# Altium schematic sheet Inrus.SchDoc
size 420 x 297 mm; SheetNumber: 1; SheetTotal: 3
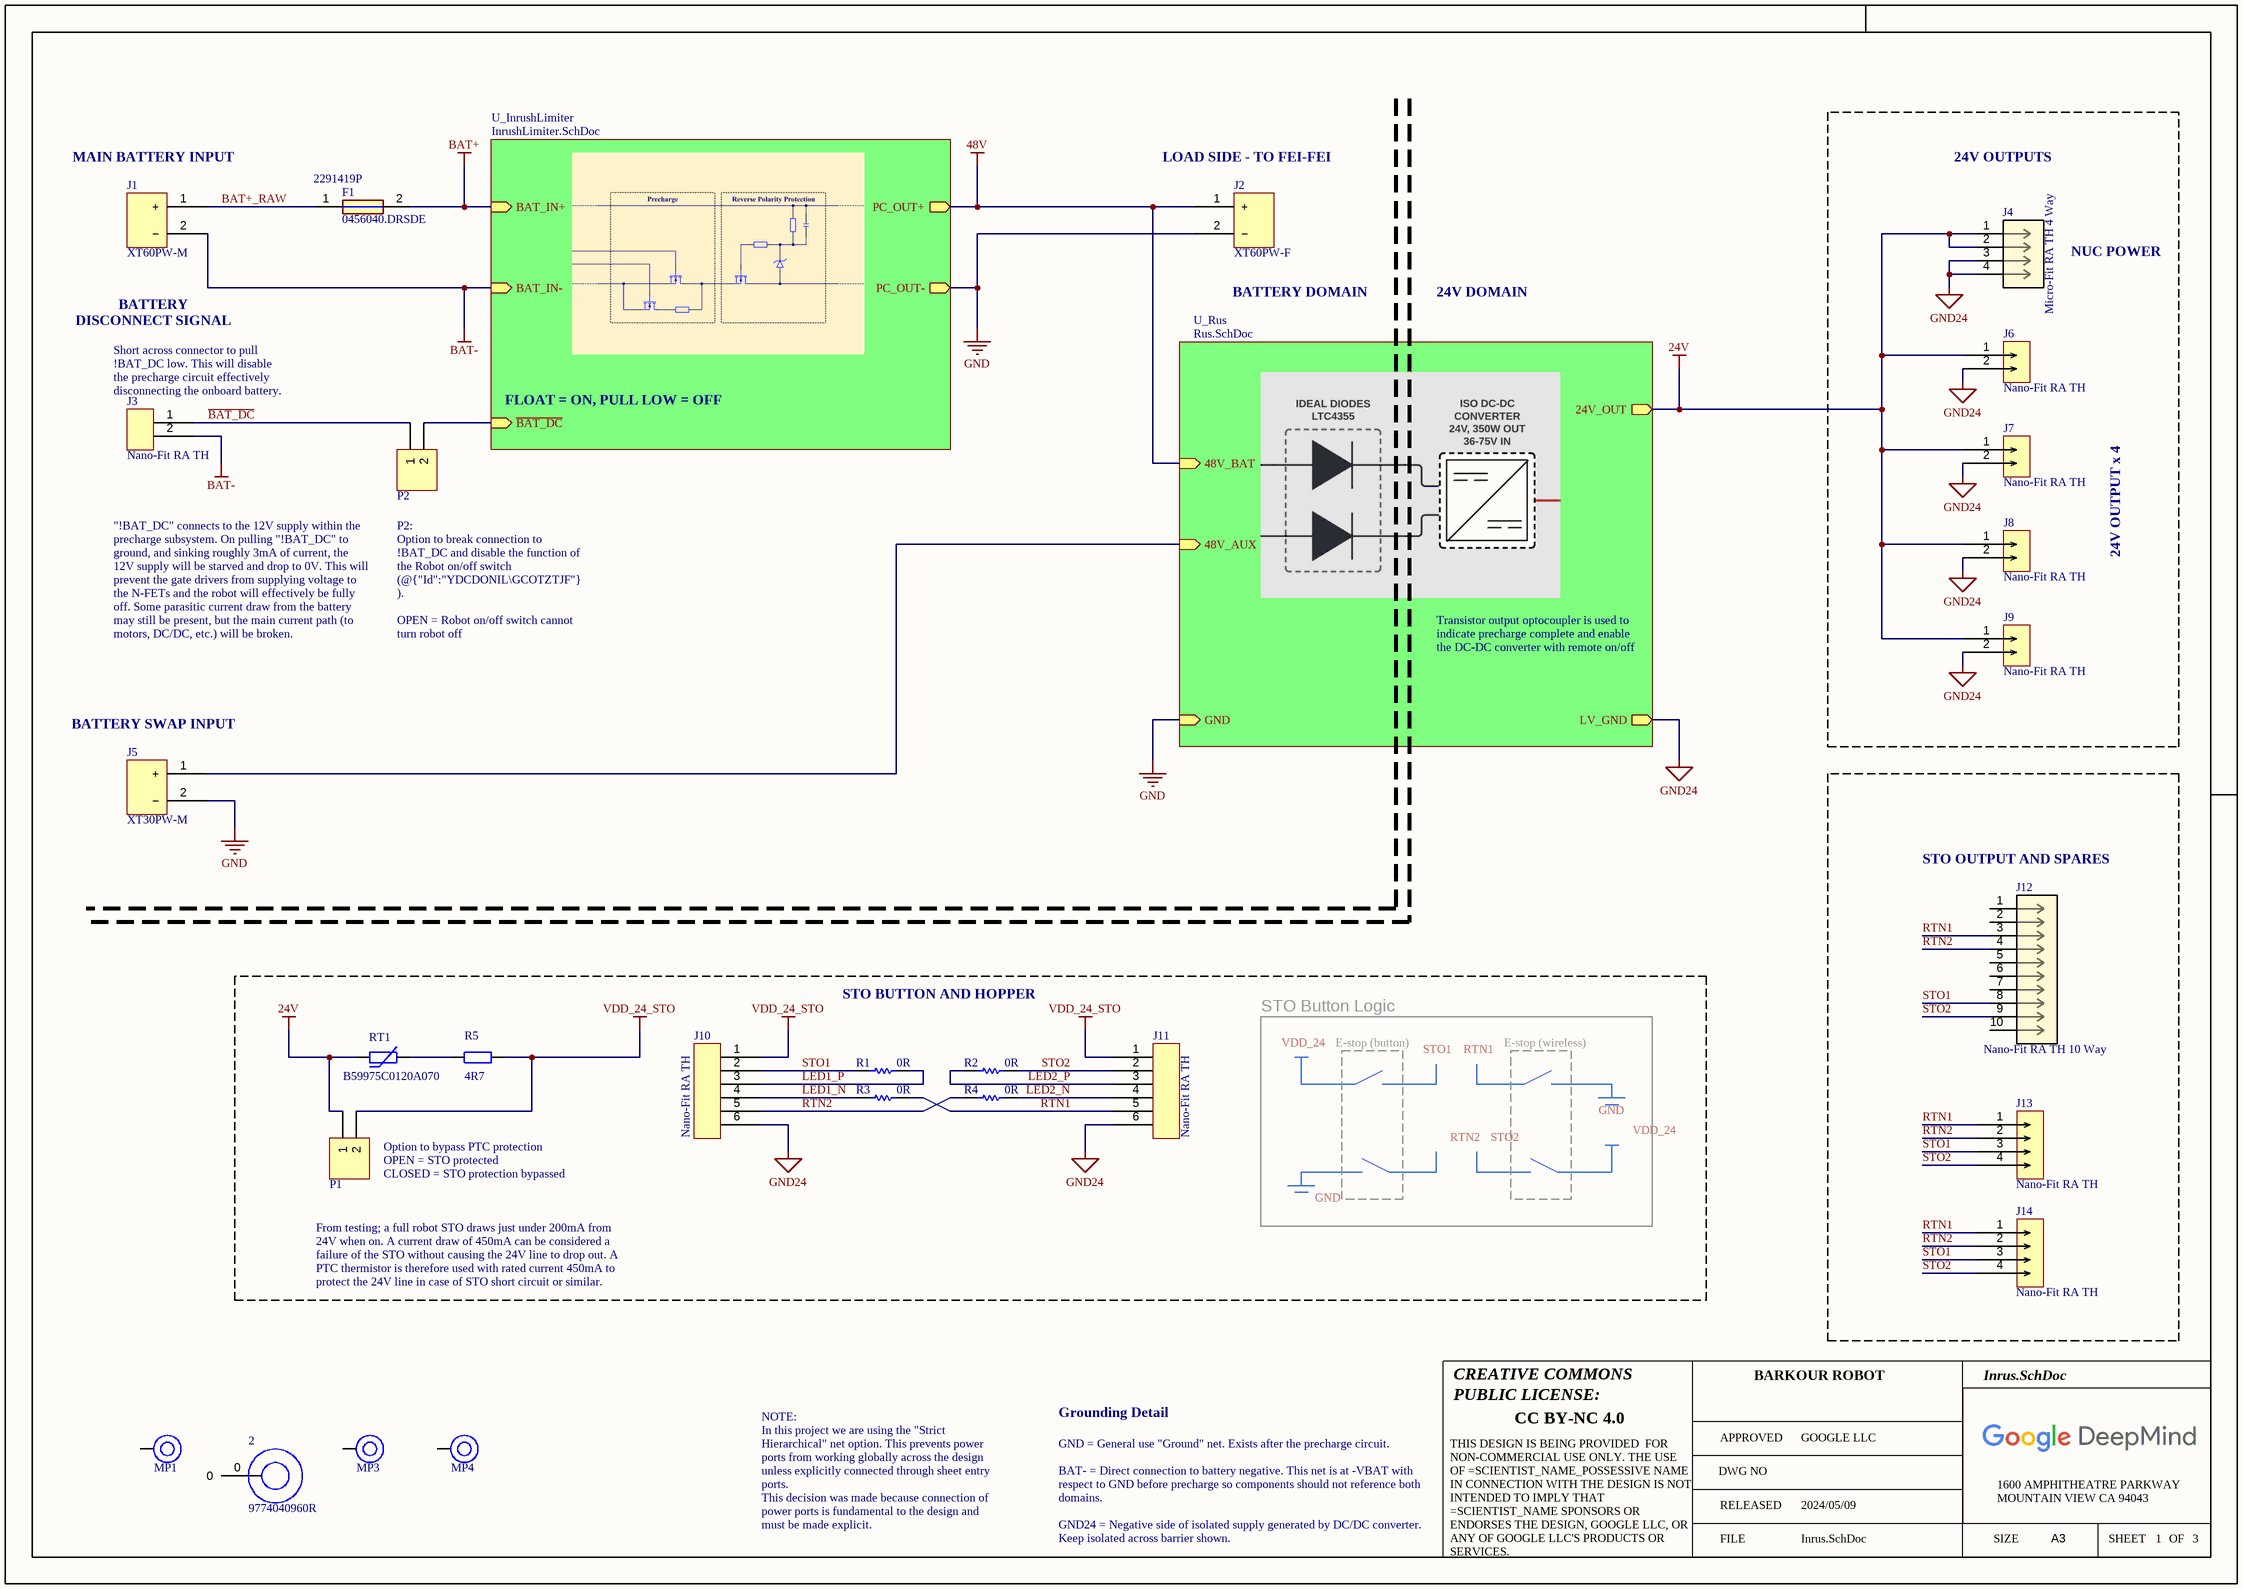
[diagram p0: Inrus.SchDoc]

## Parts
2  9774040960R  [9774040960R]
F1  0456040.DRSDE  Supplier Part Number 1: 2291419P  [FUSC12245X450N]
J1  XT60PW-M  [XT60PW_M]
J2  XT60PW-F  [XT60PW_F]
J3  Colloquial: Nano-Fit RA TH  [MOLEX 1053131102]  (hidden comment: 105313-1202)
J4  Colloquial: Micro-Fit RA TH 4 Way  [MOLEX 430450401]  (hidden comment: 430450401)
J5  XT30PW-M  [XT30PW_M]
J6  Colloquial: Nano-Fit RA TH  [MOLEX 1053131102]  (hidden comment: 105313-1202)
J7  Colloquial: Nano-Fit RA TH  [MOLEX 1053131102]  (hidden comment: 105313-1202)
J8  Colloquial: Nano-Fit RA TH  [MOLEX 1053131102]  (hidden comment: 105313-1202)
J9  Colloquial: Nano-Fit RA TH  [MOLEX 1053131102]  (hidden comment: 105313-1202)
J10  Colloquial: Nano-Fit RA TH  [MOLEX 1053141206]  (hidden comment: 105314-1206)
J11  Colloquial: Nano-Fit RA TH  [MOLEX 1053141206]  (hidden comment: 105314-1206)
J12  Colloquial: Nano-Fit RA TH 10 Way  [MOLEX 1053141110]  (hidden comment: 1053141310)
J13  Colloquial: Nano-Fit RA TH  [MOLEX 1053141204]  (hidden comment: 105314-1204)
J14  Colloquial: Nano-Fit RA TH  [MOLEX 1053141204]  (hidden comment: 105314-1204)
MP1  M3 x 4mm  [9774040360]  (value not drawn)
MP3  M3 x 4mm  [9774040360]  (value not drawn)
MP4  M3 x 4mm  [9774040360]  (value not drawn)
P1  Header 2  [HDR1X2]  (value not drawn)
P2  Header 2  [HDR1X2]  (value not drawn)
R1  Resistance: 0R  [RESC1608X55X25ML10T15]  (hidden comment: RC0603JR-070RL)
R2  Resistance: 0R  [RESC1608X55X25ML10T15]  (hidden comment: RC0603JR-070RL)
R3  Resistance: 0R  [RESC1608X55X25ML10T15]  (hidden comment: RC0603JR-070RL)
R4  Resistance: 0R  [RESC1608X55X25ML10T15]  (hidden comment: RC0603JR-070RL)
R5  4R7  [RES 2512_6432]
RT1  B59975C0120A070  [RES THERM TH 9.0x12.5 DISC LEADED]

## Blocks framed on the sheet
STO OUTPUT AND SPARES: J12-J14
STO Button Logic: J10 J11 P1 R1-R5 RT1

## Sub-sheets
U_InrushLimiter = InrushLimiter.SchDoc: BAT_IN+ (in), BAT_IN- (in), PC_OUT+ (out), PC_OUT- (out), ~{BAT_DC} (in)
U_Rus = Rus.SchDoc: 48V_BAT (in), 48V_AUX (in), 24V_OUT (out), LV_GND (out), GND (in)

## Nets
24V: J4.1 J4.2 J6.1 J7.1 J8.1 J9.1 P1.1 RT1.1 ; sheet U_Rus/24V_OUT
48V: J2.1(+) ; sheet U_InrushLimiter/PC_OUT+, sheet U_Rus/48V_BAT
BAT+: F1.2 ; sheet U_InrushLimiter/BAT_IN+
BAT-: J1.2(−) J3.2 ; sheet U_InrushLimiter/BAT_IN-
GND: J2.2(−) J5.2(−) ; sheet U_InrushLimiter/PC_OUT-, sheet U_Rus/GND
GND24: J4.3 J4.4 J6.2 J7.2 J8.2 J9.2 J10.6 J11.6 ; sheet U_Rus/LV_GND
VDD_24_STO: J10.1 J11.1 P1.2 R5.2
~{BAT_DC}: J3.1 P2.1
BAT+_RAW: F1.1 J1.1(+)
LED1_N: J10.4 R3.2
LED1_P: J10.3 R1.1
LED2_N: J11.4 R4.2
LED2_P: J11.3 R2.1
RTN1: J11.5 J12.3 J13.1 J14.1 R3.1
RTN2: J10.5 J12.4 J13.2 J14.2 R4.1
STO1: J10.2 J12.8 J13.3 J14.3 R1.2
STO2: J11.2 J12.9 J13.4 J14.4 R2.2
NetJ5_1: J5.1(+) ; sheet U_Rus/48V_AUX
NetP2_2: P2.2 ; sheet U_InrushLimiter/~{BAT_DC}
NetR5_1: R5.1 RT1.2

Not connected (* = marked no-connect by the designer): 2 0; J12 1 2 5 6 7 10; MP1 1; MP3 1; MP4 1

## Notes on the sheet
- (near J1) MAIN BATTERY INPUT
- (near J2) LOAD SIDE - TO FEI-FEI
- 24V OUTPUTS
- NUC POWER
- BATTERY DOMAIN
- 24V DOMAIN
- BATTERY DISCONNECT SIGNAL
- (near J3) Short across connector to pull !BAT_DC low. This will disable the precharge circuit effectively disconnecting the onboard battery.
- FLOAT = ON, PULL LOW = OFF
- 24V OUTPUT x 4
- "!BAT_DC" connects to the 12V supply within the precharge subsystem. On pulling "!BAT_DC" to ground, and sinking roughly 3mA of current, the 12V supply will be starved and drop to 0V. This will prevent the gate drivers from supplying voltage to the N-FETs and the robot will effectively be fully off. Some parasitic current draw from the battery may still be present, but the main current path (to motors, DC/DC, etc.) will be broken.
- P2:
  Option to break connection to !BAT_DC and disable the function of the Robot on/off switch (@{"Id":"YDCDONIL\GCOTZTJF"} ).
  OPEN = Robot on/off switch cannot turn robot off
  CLOSED (default) = Robot on/off switch functional
- (near J5) BATTERY SWAP INPUT
- Transistor output optocoupler is used to indicate precharge complete and enable the DC-DC converter with remote on/off
- STO BUTTON AND HOPPER
- VDD_24
- E-stop (button)
- STO1
- RTN1
- E-stop (wireless)
- GND
- (near P1) Option to bypass PTC protection
  OPEN = STO protected
  CLOSED = STO protection bypassed
- RTN2
- STO2
- From testing; a full robot STO draws just under 200mA from 24V when on. A current draw of 450mA can be considered a failure of the STO without causing the 24V line to drop out. A PTC thermistor is therefore used with rated current 450mA to protect the 24V line in case of STO short circuit or similar.
- Grounding Detail
- NOTE:
  In this project we are using the "Strict Hierarchical" net option. This prevents power ports from working globally across the design unless explicitly connected through sheet entry ports.
  This decision was made because connection of power ports is fundamental to the design and must be made explicit.
- GND = General use "Ground" net. Exists after the precharge circuit.
  BAT- = Direct connection to battery negative. This net is at -VBAT with respect to GND before precharge so components should not reference both domains.
  GND24 = Negative side of isolated supply generated by DC/DC converter. Keep isolated across barrier shown.
- CREATIVE COMMONS
- PUBLIC LICENSE:
- BARKOUR ROBOT
- CC BY-NC 4.0
- APPROVED
- DWG NO
- GOOGLE LLC
- FILE
- RELEASED
- 2024/05/09
- SIZE
- 1600 AMPHITHEATRE PARKWAY
- MOUNTAIN VIEW CA 94043
- A3
- SHEET
- OF
- THIS DESIGN IS BEING PROVIDED  FOR NON-COMMERCIAL USE ONLY. THE USE OF =SCIENTIST_NAME_POSSESSIVE NAME IN CONNECTION WITH THE DESIGN IS NOT INTENDED TO IMPLY THAT =SCIENTIST_NAME SPONSORS OR ENDORSES THE DESIGN, GOOGLE LLC, OR ANY OF GOOGLE LLC'S PRODUCTS OR SERVICES.

## Library data of the parts
2 = 9774040960R: Spacer Material: Steel Mounting: SMT Series: WA-SMST For ø: 3.3 mm; Manufacturer: Wurth Electronics; Plating: Tin; Threaded/Unthreaded: Unthreaded; Inside Diameter: 0.13inch; Outside Diameter: 0.236inch; Supplier 1: Digi-Key; Manufacturer Part Number: 9774040960R; RoHS: Yes; Category: Spacers, Standoffs; Stock 1: 190; Pricing 1: 1=1.79000, 10=1.71600, 50=1.50700, 100=1.40200 (USD); Material: Steel; Length: 0.213inch; REACH SVHC: Unknown; ComponentLink1URL: http://www.farnell.com/datasheets/1960394.pdf?src-supplier=Farnell; ComponentLink1Description: http://www.farnell.com/datasheets/1960394.pdf?src-supplier=Farnell; ComponentLink2URL: http://www.mouser.com/ds/2/445/9774040960R-611108.pdf?src-supplier=Mouser; ComponentLink2Description: http://www.mouser.com/ds/2/445/9774040960R-611108.pdf?src-supplier=Mouser; ComponentLink3URL: https://media.digikey.com/pdf/Data%20Sheets/Wurth%20Electronics%20PDFs/WA-SMSx_Performance_Flyer.pdf?src-supplier=Digi-Key; ComponentLink3Description: https://media.digikey.com/pdf/Data%20Sheets/Wurth%20Electronics%20PDFs/WA-SMSx_Performance_Flyer.pdf?src-supplier=Digi-Key; ComponentLink4URL: http://www.farnell.com/datasheets/1960394.pdf?src-supplier=Element14; ComponentLink4Description: http://www.farnell.com/datasheets/1960394.pdf?src-supplier=Element14; ComponentLink5URL: http://www.farnell.com/datasheets/1960394.pdf?src-supplier=Newark; ComponentLink5Description: http://www.farnell.com/datasheets/1960394.pdf?src-supplier=Newark; Supplier Part Number 1: 732-7092-1-ND
F1 = 0456040.DRSDE: Electric Fuse, Fast Blow, 40A, 250VAC, 80VDC, 150A (IR), Surface Mount, NANO; Manufacturer_Name: LITTELFUSE; Datasheet Link: https://www.littelfuse.com/~/media/electronics/datasheets/fuses/littelfuse_fuse_456sde_datasheet.pdf.pdf; Height: 4.5mm; Manufacturer_Part_Number: 0456040.DRSDE; Mouser Part Number: 576-0456040.DRSDE; Mouser Price/Stock: https://www.mouser.co.uk/ProductDetail/Littelfuse/0456040.DRSDE?qs=iLbezkQI%252Bsg1J2n4oyxfKg%3D%3D; Supplier 1: Rs; Manufacturer: Littelfuse; Manufacturer Part Number: 0456040.DRSDE; RoHS: Yes; Category: Fuses; Stock 1: 1372; Pricing 1: 50=3.055, 100=2.55, 250=2.475, 500=2.115 (GBP)
J1 = XT60PW-M: Amass XT60 RA TH male header; Manufacturer: Amass; Manufacturer Part Number: XT60PW-M
J2 = XT60PW-F: Amass XT60 RA TH female header; Manufacturer: Amass; Manufacturer Part Number: XT60PW-F
J3 J6-J9 = Nano-Fit RA TH 2 Way Header: Nano-Fit Right Angle Header; Through Hole; 2.50mm; Single Row; 2 Circuit; Gold Plated; Manufacturer: Molex; Gender: Male; Supplier 1: RSComponents; Manufacturer Part Number: 105313-1202; RoHS: Yes; Category: Headers and Wire Housings; Stock 1: 621; Pricing 1: 10=1.38000 (GBP); Mount: Through Hole; Contact Plating: Gold; Contact Material: Brass; Color: Black; Termination: Through Hole; Number of Rows: 1; REACH SVHC: Unknown; RoHS Compliant: Yes; Supplier Part Number 1: 1225087
J4 = Micro-Fit RA TH 4 Way Header Dual Row: Header, 2 Row, Right-Angle, Snap-In Lock, 4 Pin, Gold Plate, SMT/Glow Wire Compatible; Manufacturer: Molex; Copyright: Copyright (C) 2022 Ultra Librarian. All rights reserved.; Manufacturer Part Number: 430450401; RefDes: RefDes; Type: DEV; Supplier 1: RSComponents; RoHS: Yes; Category: Headers and Wire Housings; Stock 1: 2315; Pricing 1: 5=1.54600, 100=1.21000, 375=1.08600, 1500=0.86200, 3000=0.80000 (GBP); ComponentLink1URL: https://datasheet.ciiva.com/5153/0430450401-pcb-headers-142810-5153780.pdf?src-supplier=Mouser; ComponentLink1Description: https://datasheet.ciiva.com/5153/0430450401-pcb-headers-142810-5153780.pdf?src-supplier=Mouser; ComponentLink2URL: https://datasheet.ciiva.com/31838/151680430450401-pcb-headers-31838471.pdf?src-supplier=Onlinecomponents.com; ComponentLink2Description: https://datasheet.ciiva.com/31838/151680430450401-pcb-headers-31838471.pdf?src-supplier=Onlinecomponents.com; ComponentLink3URL: https://datasheet.ciiva.com/11749/0900766b80d483ee-11749369.pdf?src-supplier=RSComponents; ComponentLink3Description: https://datasheet.ciiva.com/11749/0900766b80d483ee-11749369.pdf?src-supplier=RSComponents; ComponentLink4URL: https://datasheet.ciiva.com/10090/0430450401-pcb-headers-10090512.pdf?src-supplier=Avnet; ComponentLink4Description: https://datasheet.ciiva.com/10090/0430450401-pcb-headers-10090512.pdf?src-supplier=Avnet; ComponentLink5URL: https://datasheet.ciiva.com/1443/1780486-1443445.pdf?src-supplier=Element14; ComponentLink5Description: https://datasheet.ciiva.com/1443/1780486-1443445.pdf?src-supplier=Element14; Supplier Part Number 1: 6700321
J5 = XT30PW-M: Amass XT30 RA TH male header; Manufacturer: Amass; Manufacturer Part Number: XT30PW-M
J10 J11 = Nano-Fit RA TH 6 Way Header Dual Row: Nano-Fit Right Angle Header; Through Hole; 2.50mm; Dual Row; 6 Circuit; Gold Plated; Manufacturer: Molex; Gender: Male; Manufacturer Part Number: 105314-1206; RoHS: Yes; Category: Headers and Wire Housings; Stock 1: 621; Pricing 1: 10=1.38000 (GBP); Mount: Through Hole; Contact Plating: Gold; Contact Material: Brass; Color: Black; Termination: Through Hole; Number of Rows: 2; REACH SVHC: Unknown; RoHS Compliant: Yes; Supplier 1: Farnell; Supplier Part Number 1: 2576871
J12 = Nano-Fit RA TH 10 Way Header: Nano-Fit Right Angle Header; Through Hole; 2.50mm; Dual Row; 10 Circuit; Gold Plating; Manufacturer: Molex; Copyright: Copyright (C) 2022 Ultra Librarian. All rights reserved.; Manufacturer Part Number: 1053141310; RefDes: RefDes; Type: DEV
J13 J14 = Nano-Fit RA TH 4 Way Header Dual Row: Nano-Fit Right Angle Header; Through Hole; 2.50mm; Dual Row; 4 Circuit; Gold Plated; Manufacturer Part Number: 105314-1204
MP1 MP3 MP4 = 9774040360R: WA-SMSI SMT Steel Spacer with internal Thread, OD 6mm, M3 x 4mm; Manufacturer: Wurth Elektronik; Inside Diameter: 4.2mm; Surface: Tin; ComponentLink1Description: Website Link; ComponentLink1URL: https://www.we-online.com/redexpert/article/9774040360R?ad; ComponentLink2Description: Datasheet Link; ComponentLink2URL: https://www.we-online.com/redexpert/spec/9774040360R?ad; Manufacturer Part Number: 9774040360R; Category: SMT Spacers; Match Code: WA-SMSI; Mount: Surface Mount; Operating Temperature Max: 150°C; Operating Temperature Min: -55°C; Packaging: Tape and Reel; Height: 4mm; Material: Steel; Outside Diameter: 6mm; Thread Size: M3
P1 P2 = Header 2: Header, 2-Pin; LatestRevisionDate: 17-Jul-2002; LatestRevisionNote: Re-released for DXP Platform.; Publisher: Altium Limited
R1-R4 = CMP-2100-03667-1: Chip Resistor, 0 Ohm, +/- 5%, 0.1 W, -55 to 155 degC, 0603 (1608 Metric), RoHS, Tape and Reel; Manufacturer: Yageo; Temperature Coefficient: 200ppm/degreesC; Voltage Rating: 50V; Power Rating: 100mW; Width: 0.8mm; Max Operating Temperature: 155degC; Tolerance: 5%; Package Reference: 0603; Height: 0.45mm; Depth: 0.8mm; Package Description: 2-Pin Surface Mount Device, Body 1.6 x 0.8 mm; Termination: SMD/SMT; Package Quantity: 5000; Case/Package: 0603; Case Code (Imperial): 0603; Radiation Hardening: No; Number of Pins: 2; Length: 1.6mm; Lead Free: LeadFree; Voltage Rating (DC): 50V; Military Standard: Not; Datasheet URL: http://www.yageo.com/NewPortal/yageodocoutput?fileName=/pdf/R-Chip/PYu-RC_Group_51_RoHS_L_5.pdf; Manufacturer URL: http://www.yageo.com/; Packaging: TapeandReel; Case Code (Metric): 1608; Min Operating Temperature: -55degC; Composition: ThickFilm; RoHSCompliant: true; Contact Plating: Tin; Datasheet Version: Rev. 5, 10/2016; REACH SVHC: NoSVHC
R5 = R: Generic Resistor; Tolerance: 1%; Voltage Rating: 200V; Power Rating: 1000mW; Temperature Coefficient: 100ppm/°C; Size Code: 2512; Resistance: 4R7
RT1 = B59975C0120A070: Thermistor PTC 1.8 Ohm 25% 2-Pin Radial Cardboard Strip; Manufacturer: Epcos; Max Supply Voltage: 30V; Lead Length: 25mm; Manufacturer Part Number: B59975C0120A070; Supplier 1: Farnell; RoHS: Yes; Category: PTC Resettable Fuses; Stock 1: 1677; Pricing 1: 1=1.56000, 10=1.23000, 50=0.92700, 100=0.83300, 200=0.72800, 500=0.62200, 2500=0.61000 (GBP); Mount: Through Hole; Case/Package: Radial; Number of Pins: 2; Contact Plating: Tin; Min Operating Temperature: -40°C; Max Operating Temperature: 125°C; Packaging: Strip; Tolerance: 25%; Operating Supply Voltage: 30V; Width: 9mm; Height: 12.5mm; Depth: 3.5mm; Thickness: 3.5mm; Radiation Hardening: No; REACH SVHC: No SVHC; Lead Free: Lead Free; RoHS Compliant: Yes; ComponentLink1URL: https://datasheet.ciiva.com/15097/getdatasheetpartid-382302-15097925.pdf?src-supplier=Verical; ComponentLink1Description: https://datasheet.ciiva.com/15097/getdatasheetpartid-382302-15097925.pdf?src-supplier=Verical; ComponentLink2URL: https://datasheet.ciiva.com/48779/1899685-48779500.pdf?src-supplier=Element14; ComponentLink2Description: https://datasheet.ciiva.com/48779/1899685-48779500.pdf?src-supplier=Element14; Supplier Part Number 1: 9753087